# EAGLE design MTRduino_Rev2.1 (EAGLE 7.0.0)
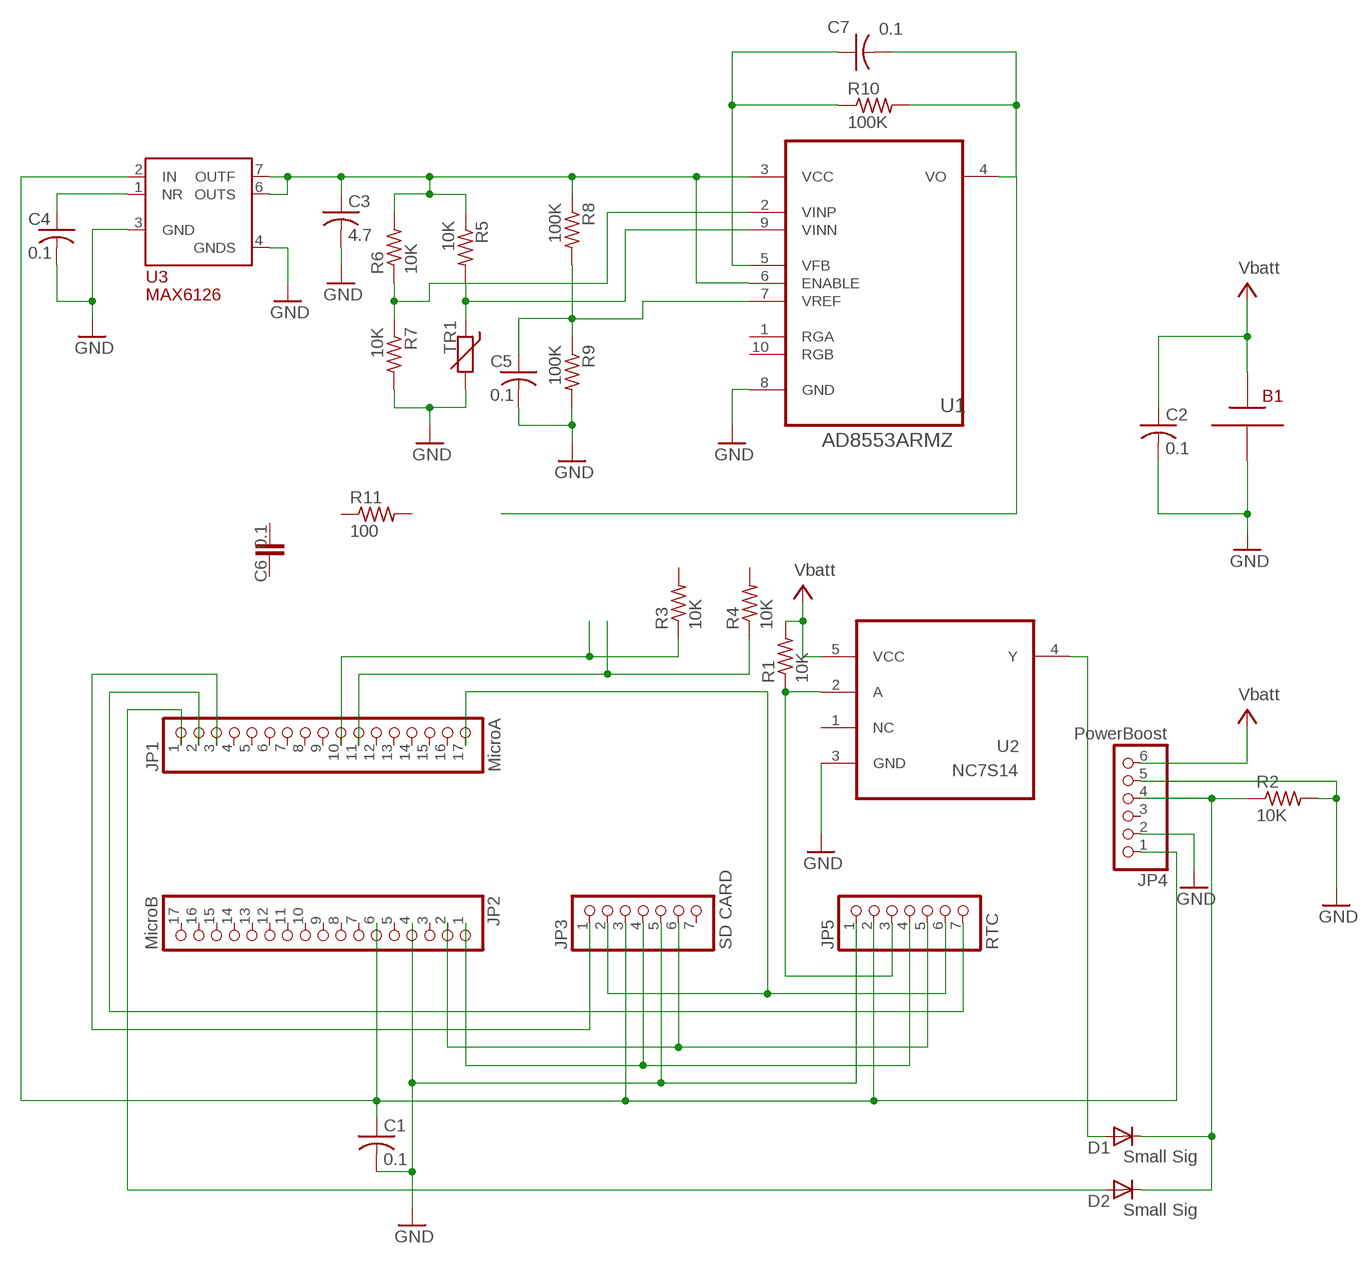
[diagram p0: schematic, sheet 1]

## Parts
B1  2x AA BATT  BATT_AA2  [BATT_AA2]
C1  0.1  C-USC0603  [C0603]
C2  0.1  C-USC0603  [C0603]
C3  4.7  C-USC0603  [C0603]
C4  0.1  C-USC0603  [C0603]
C5  0.1  C-USC0603  [C0603]
C6  0.1  C-EUC0603  [C0603]
C7  0.1  C-USC0603  [C0603]
D1  Small Sig  DIODESOD-323F  [SOD-323F]
D2  Small Sig  DIODESOD-323F  [SOD-323F]
JP1  MicroA  PINHD-1X17  [1X17]
JP2  MicroB  PINHD-1X17  [1X17]
JP3  SD CARD  PINHD-1X7  [1X07]
JP4  PowerBoost  PINHD-1X6  [1X06]
JP5  RTC  PINHD-1X7  [1X07]
R1  10K  R-US_R0603  [R0603]
R2  10K  R-US_R0603  [R0603]
R3  10K  R-US_R0603  [R0603]
R4  10K  R-US_R0603  [R0603]
R5  10K  R-US_R0603  [R0603]
R6  10K  R-US_R0603  [R0603]
R7  10K  R-US_R0603  [R0603]
R8  100K  R-US_R0603  [R0603]
R9  100K  R-US_R0603  [R0603]
R10  100K  R-US_R0603  [R0603]
R11  100  R-US_R0603  [R0603]
TR1  10K  THERMISTOR_R-5  [R-5]
U1  AD8553ARMZ  [SOP50P490X110-10N]
U2  NC7S14  1P1G14MDBVREPG4  [SOT95P280X145-5N]
U3  MAX6126  [SOIC127P600X175-8N]

## Nets
GND: B1.- C1.2 C2.2 C3.2 C4.2 C5.2 JP2.4 JP3.5 JP4.2 JP4.5 JP5.1 R2.2 R7.2 R9.2 TR1.2 U1.8(GND) U2.3(GND) U3.3(GND) U3.4(GNDS)
N$1: D1.A U2.4(Y)
N$2: C7.2 R10.2 U1.4(VO)
N$3: JP1.2 JP5.7
N$4: C4.1 U3.1(NR)
N$5: R6.1 R7.1 U1.2(VINP)
N$6: R5.2 TR1.1 U1.9(VINN)
N$7: C7.1 R10.1 U1.5(VFB)
N$9: JP1.10 R3.1
N$10: JP1.11 R4.1
N$12: C5.1 R8.2 R9.1 U1.7(VREF)
N$14: C3.1 R5.1 R6.2 R8.1 U1.3(VCC) U1.6(ENABLE) U3.6(OUTS) U3.7(OUTF)
N$17: JP5.3 R1.1 U2.2(A)
N$18: JP1.17 JP3.2 JP5.6
N$21: D2.A JP1.1
N$31: D1.C D2.C JP4.4 R2.1
N$37: JP2.1 JP3.4 JP5.4
N$39: JP2.2 JP3.6 JP5.5
N$40: C1.1 JP2.6 JP3.3 JP4.1 JP5.2 U3.2(IN)
N$41: JP1.3 JP3.1
V+: B1.+ C2.1 JP4.6 R1.2 U2.5(VCC) ; supply symbol labelled Vbatt
Unconnected: C6.1 C6.2 JP1.4 JP1.5 JP1.6 JP1.7 JP1.8 JP1.9 JP1.12 JP1.13 JP1.14 JP1.15 JP1.16 JP2.3 JP2.5 JP2.7 JP2.8 JP2.9 JP2.10 JP2.11 JP2.12 JP2.13 JP2.14 JP2.15 JP2.16 JP2.17 JP3.7 JP4.3 R3.2 R4.2 R11.1 R11.2 U1.1(RGA) U1.10(RGB) U2.1(NC)

## Library data of the parts
B1 = adafruit:BATT_AA2
C1-C5 C7 = adafruit:C-US: CAPACITOR, American symbol
C6 = resistor:C-EU: CAPACITOR, European symbol
D1 D2 = adafruit:DIODE: Diode SMADIODE - SMA Surface Mount Package 20V 1A Schottky Diode Digikey: 641-1014-6-ND DO-1N4148 - Through Hole Small Current Diode SOD-123 20V 1 A (.5mV Vf) Schottky Diode - Digikey: MBRX120TPMSCT-ND SOD-323 10V 570mA (.38mV Vf, 3ns) Schottky Diode - Digikey: ZLLS410CT-ND SOD-523 30V 30mA Schottky Diode (RB751S-40TE61) - Digikey: RB751S-40TE61CT-ND SOT23-R/W - SOT23 Package (R = Solder Paste/Reflow Ovens, W = Hand-Soldering) BAT54Film 40V 300mA - Digikey: 497-7162-1-ND
JP1 JP2 = pinhead:PINHD-1X17: PIN HEADER
JP3 JP5 = pinhead:PINHD-1X7: PIN HEADER
JP4 = pinhead:PINHD-1X6: PIN HEADER
R1-R11 = resistor:R-US_: RESISTOR, American symbol
TR1 = discrete:THERMISTOR_: Thermo Resistor
U1 = Analog Devices_By_element14_Batch_1:AD8553ARMZ: In-Amp with Shutdown; MPN: AD8553ARMZ; OC_FARNELL: -; OC_NEWARK: 45P6466; PACKAGE: MSOP-10; SUPPLIER: Analog Devices
U2 = Texas Instruments_By_element14_Batch_1:1P1G14MDBVREPG4: SINGLE SCHMITT-TRIGGER INVERTER; MPN: 1P1G14MDBVREPG4; OC_FARNELL: -; OC_NEWARK: 56P2415; PACKAGE: SOT-23-5; SUPPLIER: Texas Instruments
U3 = Maxim_By_element14_Batch_1:MAX6126

## Board
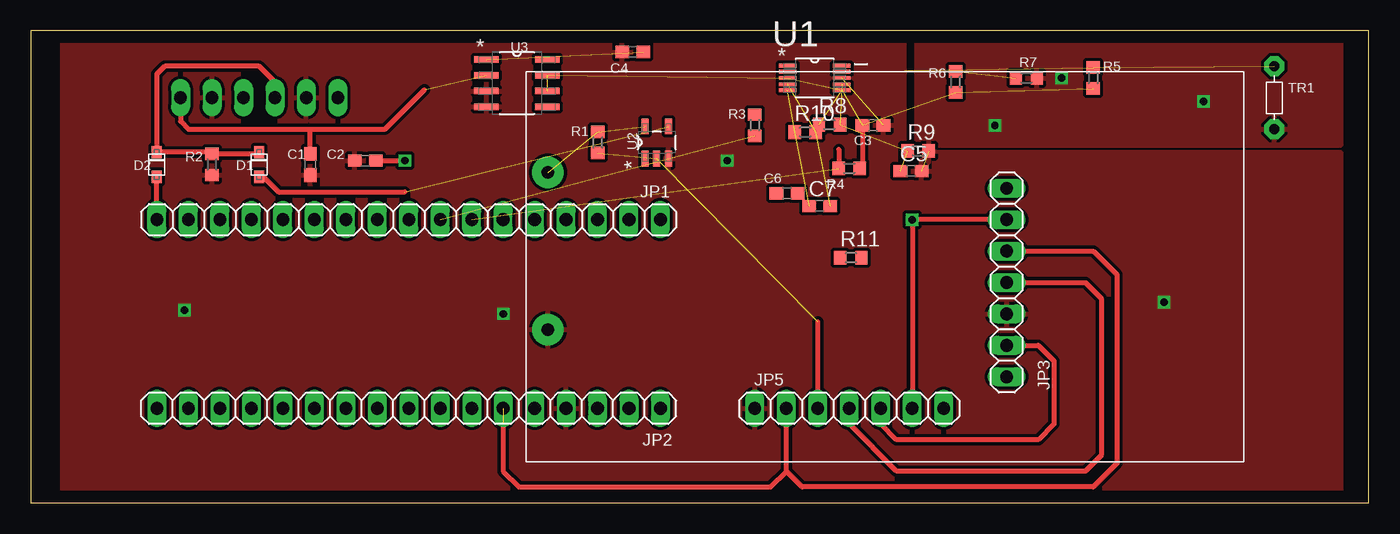
[diagram p1: board, top side]
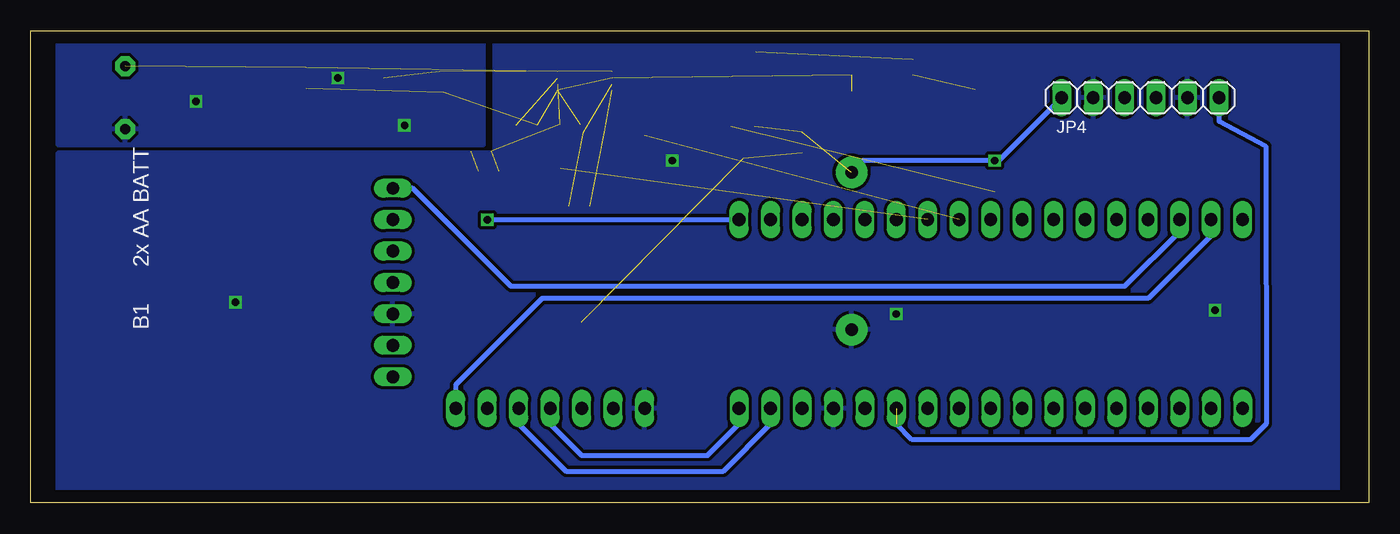
[diagram p2: board, bottom side, seen from below]

Size 107.94 x 38.09 mm. Coordinates in mm from the lower left corner, seen from the top.
Outline: 0,0 107.94,0 107.94,38.09 0,38.09 0,0
Copper layers (1*16): Top 0.035mm / dielectric 1.5mm / Bottom 0.035mm
Design rules "default *": minimum track width 10mil, minimum drill 20mil, track to track 8mil, track to pad 8mil, pad to pad 8mil, via to via 8mil, smd to smd 8mil, copper to edge 40mil, drill to drill 8mil, minimum pad ring 10mil, minimum via ring 8mil, stop-mask expansion 4mil, vias tented up to drill 0mil, thermal gap 10mil

### Footprints (pad centres in the part's own frame; a part is rotated, then mirrored left to right if it is on the bottom)
BATT_AA2 = drill 1 pad 2.54: + -27.178,7.62; - -27.178,-5.08
C0603 = smd 1.1 x 1: 1 -0.85,0; 2 0.85,0
SOD-323F = smd 1 x 0.8: A -1,0; C 1,0
1X17 = drill 1.016 long: 1 -20.32,0; 2 -17.78,0; 3 -15.24,0; 4 -12.7,0; 5 -10.16,0; 6 -7.62,0; 7 -5.08,0; 8 -2.54,0; 9 0,0; 10 2.54,0; 11 5.08,0; 12 7.62,0; 13 10.16,0; 14 12.7,0; 15 15.24,0; 16 17.78,0; 17 20.32,0
1X07 = drill 1.016 long: 1 -7.62,0; 2 -5.08,0; 3 -2.54,0; 4 0,0; 5 2.54,0; 6 5.08,0; 7 7.62,0
1X06 = drill 1.016 long: 1 -6.35,0; 2 -3.81,0; 3 -1.27,0; 4 1.27,0; 5 3.81,0; 6 6.35,0
R0603 = smd 1 x 1.1: 1 -0.85,0; 2 0.85,0
R-5 = drill 0.813 pad 1.6 octagon: 1 -2.54,0; 2 2.54,0
SOP50P490X110-10N = smd 1.422 x 0.305: 1 -2.184,0.991; 2 -2.184,0.508; 3 -2.184,0; 4 -2.184,-0.508; 5 -2.184,-0.991; 6 2.184,-0.991; 7 2.184,-0.508; 8 2.184,0; 9 2.184,0.508; 10 2.184,0.991
SOT95P280X145-5N = smd 1.27 x 0.559: 1 -1.295,0.94; 2 -1.295,0; 3 -1.295,-0.94; 4 1.295,-0.94; 5 1.295,0.94
SOIC127P600X175-8N = smd 1.981 x 0.533: 1 -2.464,1.905; 2 -2.464,0.635; 3 -2.464,-0.635; 4 -2.464,-1.905; 5 2.464,-1.905; 6 2.464,-0.635; 7 2.464,0.635; 8 2.464,1.905

### Placement (x,y rotation side)
B1  68.9,19.05 0 top
C1  22.54,27.3 270 top
C2  26.99,27.62 180 top
C3  67.94,30.48 0 top
C4  48.56,36.39 180 top
C5  71.02,26.77 0 top
C6  61.01,24.99 180 top
C7  63.65,23.95 0 top
D1  18.41,27.3 90 top
D2  10.16,27.3 90 top
JP1  30.48,22.86 0 top
JP2  30.48,7.62 180 top
JP3  78.74,17.78 270 top
JP4  18.41,32.7 180 bottom
JP5  66.04,7.62 0 top
R1  45.73,29.08 90 top
R2  14.61,27.3 270 top
R3  58.42,30.48 90 top
R4  66.04,26.99 0 top
R5  85.72,34.29 90 top
R6  74.61,33.97 270 top
R7  80.33,34.29 0 top
R8  64.44,30.53 0 top
R9  71.6,28.4 0 top
R10  62.48,29.92 0 top
R11  66.17,19.79 0 top
TR1  100.33,32.7 270 top
U1  63.25,34.29 0 top
U2  50.5,29.08 90 top
U3  39.22,33.87 0 top

### Tracks (layer width: path | path; a pad name or v marks a point on that pad's centre or on a via)
GND  (via drill 0.6)  (2 unrouted)
  other vias: 56.2,27.62 12.38,15.56 91.44,16.19 94.61,32.38 38.1,15.24 83.19,34.29 77.79,30.48
  pour Top (isolate 0.254): 2.54,38.42 2.54,-0.95 105.73,-0.95 105.73,28.26 70.48,28.26 70.48,39.37
  pour Bottom (isolate 0.254): 2.54,40.32 2.54,-0.95 105.73,-0.95 105.73,28.26 70.48,28.26 70.48,40.32
  pour Bottom (isolate 0.254): 71.44,28.89 105.73,28.89 105.73,39.69 71.44,39.69
  pour Top (isolate 0.254): 71.44,39.69 71.44,28.89 105.73,28.89 105.73,39.69
N$1  (1 unrouted)
  Top 0.406: D1.A 18.78,26.3 20,25.08 30.16,25.08
N$2  (2 unrouted)
N$3
  Bottom 0.406: JP1.2 12.7,21.59 17.78,16.51 66.67,16.51 73.66,9.53 JP5.7
N$4  (1 unrouted)
N$5  (2 unrouted)
N$6  (2 unrouted)
N$7  (2 unrouted)
N$9  (1 unrouted)
N$10  (1 unrouted)
  Top 0.406: 65.19,28.51 R4.1
N$12  (3 unrouted)
N$14  (7 unrouted)
  Top 0.406: C3.1 67.09,27.19
N$17  (2 unrouted)
  Top 0.406: JP5.3 63.5,14.61
N$18  (via drill 0.6)
  Top 0.406: JP3.2 v71.12,22.86 JP5.6
  Bottom 0.406: v71.12,22.86 JP1.17
N$21
  Top 0.406: JP1.1 D2.A
N$31
  Top 0.406: D1.C 18.27,28.16 R2.1 14.46,28.3 D2.C 10.16,34.61 10.79,35.24 18.41,35.24 19.68,33.97 JP4.4
N$37
  Top 0.406: JP3.4 85.09,17.78 86.36,16.51 86.36,3.81 85.09,2.54 69.85,2.54 66.04,6.35 JP5.4
  Bottom 0.406: JP5.4 66.04,6.35 63.5,3.81 53.34,3.81 50.8,6.35 JP2.1
N$39
  Top 0.406: JP3.6 81.28,12.7 82.55,11.43 82.55,6.35 81.28,5.08 69.85,5.08 68.58,6.35 JP5.5
  Bottom 0.406: JP5.5 68.58,6.35 64.77,2.54 52.07,2.54 48.26,6.35 JP2.2
N$40  (2 unrouted)
  Top 0.406: JP2.6 38.1,2.54 39.37,1.27 59.69,1.27 60.96,2.54 | 60.96,2.54 JP5.2 | JP3.3 85.72,20.32 87.63,18.41 87.63,3.17 85.72,1.27 62.23,1.27 60.96,2.54 | JP4.1 12.06,30.8 12.7,30.16 22.54,30.16 | C1.1 22.54,30.16 | 22.54,30.16 28.57,30.16 31.75,33.34
  Bottom 0.406: JP4.1 12.06,30.8 8.31,28.78 8.26,6.35 9.53,5.08 36.83,5.08 38.1,6.35
N$41
  Bottom 0.406: JP1.3 15.24,21.91 19.68,17.46 69.22,17.46 77.15,25.4 JP3.1
V+  (via drill 0.6)  (2 unrouted)
  Top 0.406: C2.1 v30.16,27.62
  Bottom 0.406: JP4.6 29.84,27.62 v30.16,27.62 40.77,27.62 B1.+

### Text on the board
tValues: CS | MTRDuino (Version 2.2) | DI | VCC | 12 | 11 | 10 | 9 | 8 | 7 | 6 | 5 | 4 | 3 | 2 | RS | RX | TX | SS | GND | SCK | MOSI | GND | DO | CD | 13 | 3V | AREF | A0 | A1 | A2 | A3 | A4 | A5 | NC | NC | +5V | RS | VIN | MISO | SCK | GND | SS | GND | VCC | CLK | SQW | MISO | MOSI
bValues: 5V | GND | LB | EN | GND | BAT